# Altium schematic sheet MCU.SchDoc
size A
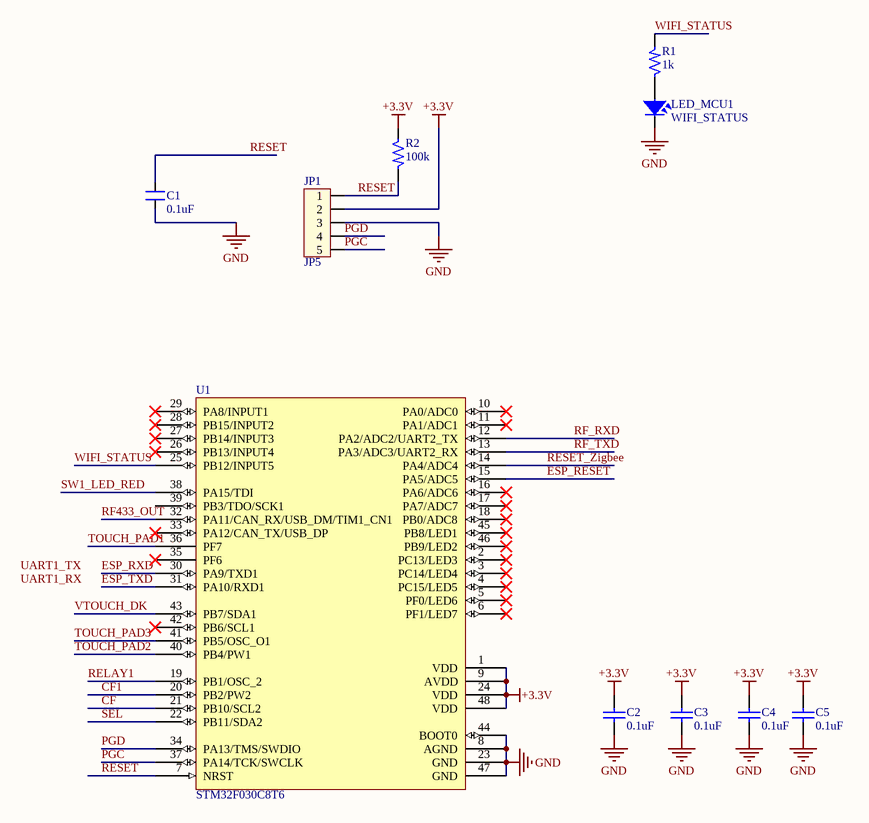
[diagram p0: MCU.SchDoc]

## Parts
C1  0.1uF  [C0603]
C2  0.1uF  [C0603]
C3  0.1uF  [C0603]
C4  0.1uF  [C0603]
C5  0.1uF  [C0603]
JP1  JP5  [HDR1x5]
LED_MCU1  WIFI_STATUS  [R0603]
R1  1k  [R0603]
R2  100k  [R0603]
U1  STM32F030C8T6  [LQFP-48]

## Nets
+3.3V: C2.2 C3.2 C4.2 C5.2 JP1.2 R2.1 U1.1(VDD) U1.9(AVDD) U1.24(VDD) U1.48(VDD)
GND: C1.1 C2.1 C3.1 C4.1 C5.1 JP1.3 LED_MCU1.2 U1.8(AGND) U1.23(GND) U1.44(BOOT0) U1.47(GND)
CF: U1.21(PB10/SCL2)
CF1: U1.20(PB2/PW2)
ESP_RESET: U1.15(PA5/ADC5)
ESP_RXD: U1.30(PA9/TXD1)
ESP_TXD: U1.31(PA10/RXD1)
PGC: JP1.5 U1.37(PA14/TCK/SWCLK)
PGD: JP1.4 U1.34(PA13/TMS/SWDIO)
RELAY1: U1.19(PB1/OSC_2)
RESET: C1.2 JP1.1 R2.2 U1.7(NRST)
RESET_Zigbee: U1.14(PA4/ADC4)
RF433_OUT: U1.32(PA11/CAN_RX/USB_DM/TIM1_CN1)
RF_RXD: U1.12(PA2/ADC2/UART2_TX)
RF_TXD: U1.13(PA3/ADC3/UART2_RX)
SEL: U1.22(PB11/SDA2)
SW1_LED_RED: U1.38(PA15/TDI)
TOUCH_PAD1: U1.36(PF7)
TOUCH_PAD2: U1.40(PB4/PW1)
TOUCH_PAD3: U1.41(PB5/OSC_O1)
VTOUCH_DK: U1.43(PB7/SDA1)
WIFI_STATUS: R1.2 U1.25(PB12/INPUT5)
NetLED_MCU1_1: LED_MCU1.1 R1.1

Not connected (* = marked no-connect by the designer): U1 2(PC13/LED3)* 3(PC14/LED4)* 4(PC15/LED5)* 5(PF0/LED6)* 6(PF1/LED7)* 10(PA0/ADC0)* 11(PA1/ADC1)* 16(PA6/ADC6)* 17(PA7/ADC7)* 18(PB0/ADC8)* 26(PB13/INPUT4)* 27(PB14/INPUT3)* 28(PB15/INPUT2)* 29(PA8/INPUT1)* 33(PA12/CAN_TX/USB_DP)* 35(PF6)* 39(PB3/TDO/SCK1) 42(PB6/SCL1)* 45(PB8/LED1)* 46(PB9/LED2)*

## Notes on the sheet
- Labels drawn without touching a wire or pin: UART1_RX, UART1_TX

## Library data of the parts
C1 = CAP: Cremic For Xtal 1pF => 100pF; Value: 33pF
C2-C5 = Cap Semi: Capacitor (Semiconductor SIM Model); Published: 8-Jun-2000; LatestRevisionDate: 29-May-2009; LatestRevisionNote: IPC-7351 Footprint Added.; PackageReference: C1206; Publisher: Altium Limited; PackageDescription: Chip Capacitor; Value: 0.1uF
JP1 = Con5: Connector 5; Value: Connector 5
LED_MCU1 = LED: LED Single colour Green and Red; Value: LED 3 ly Single Colour
R1 R2 = R: Resistor 1/4W; Value: R1/4W - 1K
U1 = STM32F103C8T6: 32bits STM32 48 Pins; Value: STM32F103C8T6